# Altium schematic sheet 5VCircuit.SchDoc
size A4
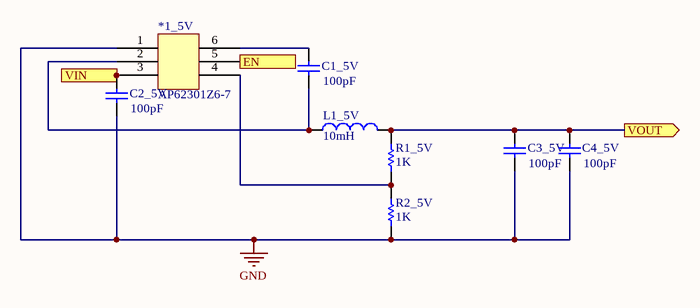
[diagram p0: 5VCircuit.SchDoc]

## Parts
*1_5V  AP62301Z6-7  [SOT-563-6]
C1_5V  value 100pF  [1608[0603]]  (hidden comment: Cap)
C2_5V  value 100pF  [1608[0603]]  (hidden comment: Cap)
C3_5V  value 100pF  [1608[0603]]  (hidden comment: Cap)
C4_5V  value 100pF  [1608[0603]]  (hidden comment: Cap)
L1_5V  value 10mH  [0402-A]  (hidden comment: Inductor)
R1_5V  value 1K  [1608[0603]]  (hidden comment: Res1)
R2_5V  value 1K  [1608[0603]]  (hidden comment: Res1)

## Ports
EN (in), VIN (in), VOUT (out)

## Nets
GND: *1_5V.1 C2_5V.1 C3_5V.1 C4_5V.1 R2_5V.2
EN: *1_5V.5 ; port EN
VIN: *1_5V.3 C2_5V.2 ; port VIN
VOUT: C3_5V.2 C4_5V.2 L1_5V.2 R1_5V.1 ; port VOUT
Net*1_5V_2: *1_5V.2 C1_5V.1 L1_5V.1
Net*1_5V_4: *1_5V.4 R1_5V.2 R2_5V.1
Net*1_5V_6: *1_5V.6 C1_5V.2

## Library data of the parts
*1_5V = AP62301Z6-7: Switching Voltage Regulators DCDC Conv HV Buck SOT563 T&R 3K
C1_5V C2_5V C3_5V C4_5V = Cap: Capacitor; Published: 8-Jun-2000; LatestRevisionDate: 17-Jul-2002; LatestRevisionNote: Re-released for DXP Platform.; PackageReference: RAD-0.3; Publisher: Altium Limited; PackageDescription: Radial Cap, Thru-Hole; 2 Leads; 0.3 in Pin Spacing
L1_5V = Inductor: Code_IEC: 1005; Published: 8-Jun-2000; LatestRevisionDate: 29-May-2009; LatestRevisionNote: IPC-7351 Footprint Added.; PackageReference: 0402-A; Publisher: Altium Limited; PackageDescription: Chip Inductor; Code_JEITA: 0402
R1_5V R2_5V = Res1: Resistor; Published: 8-Jun-2000; LatestRevisionDate: 17-Jul-2002; LatestRevisionNote: Re-released for DXP Platform.; PackageReference: AXIAL-0.3; Publisher: Altium Limited; PackageDescription: Axial Device, Thru-Hole; 2 Leads; 0.3 in Pin Spacing